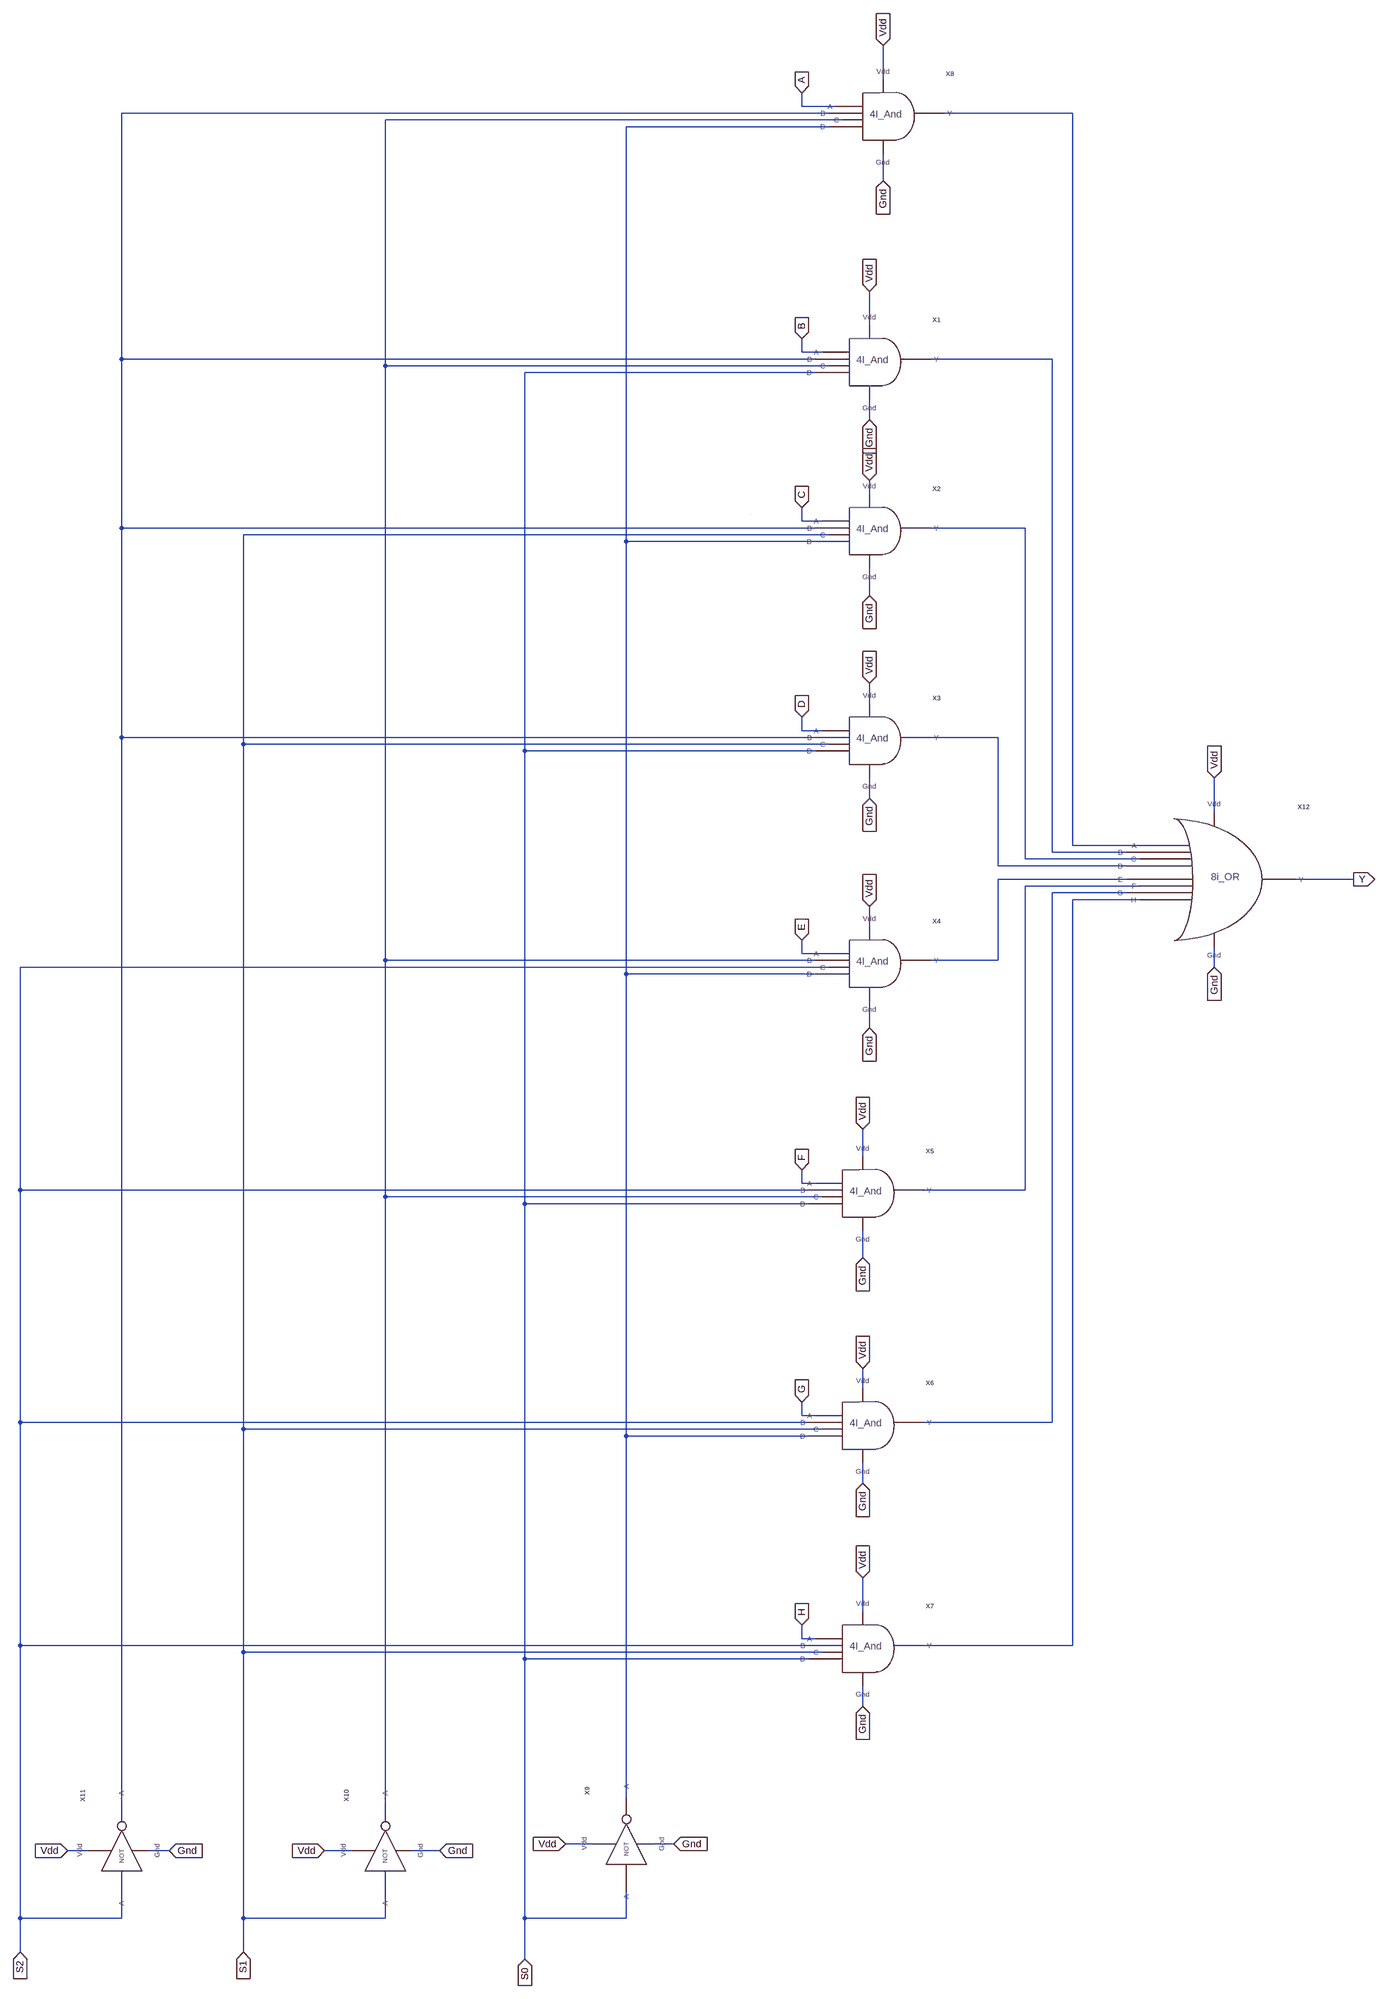
[diagram p0: schematic ALU_MUX.asc]
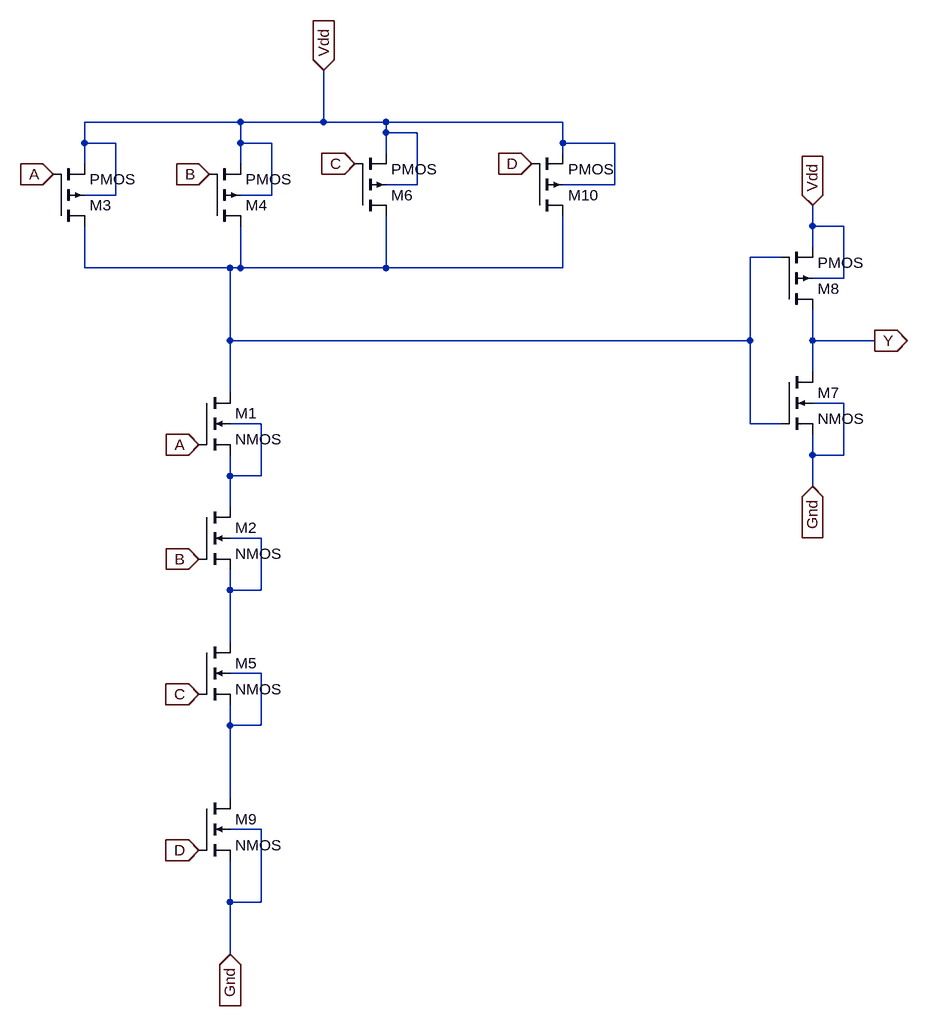
[diagram p1: sub-circuit 4iand.asc]
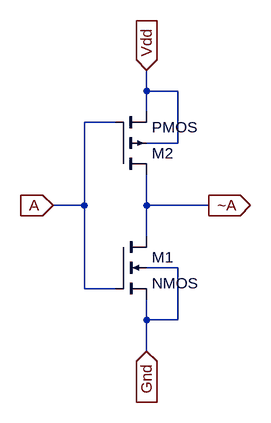
[diagram p2: sub-circuit not.asc]
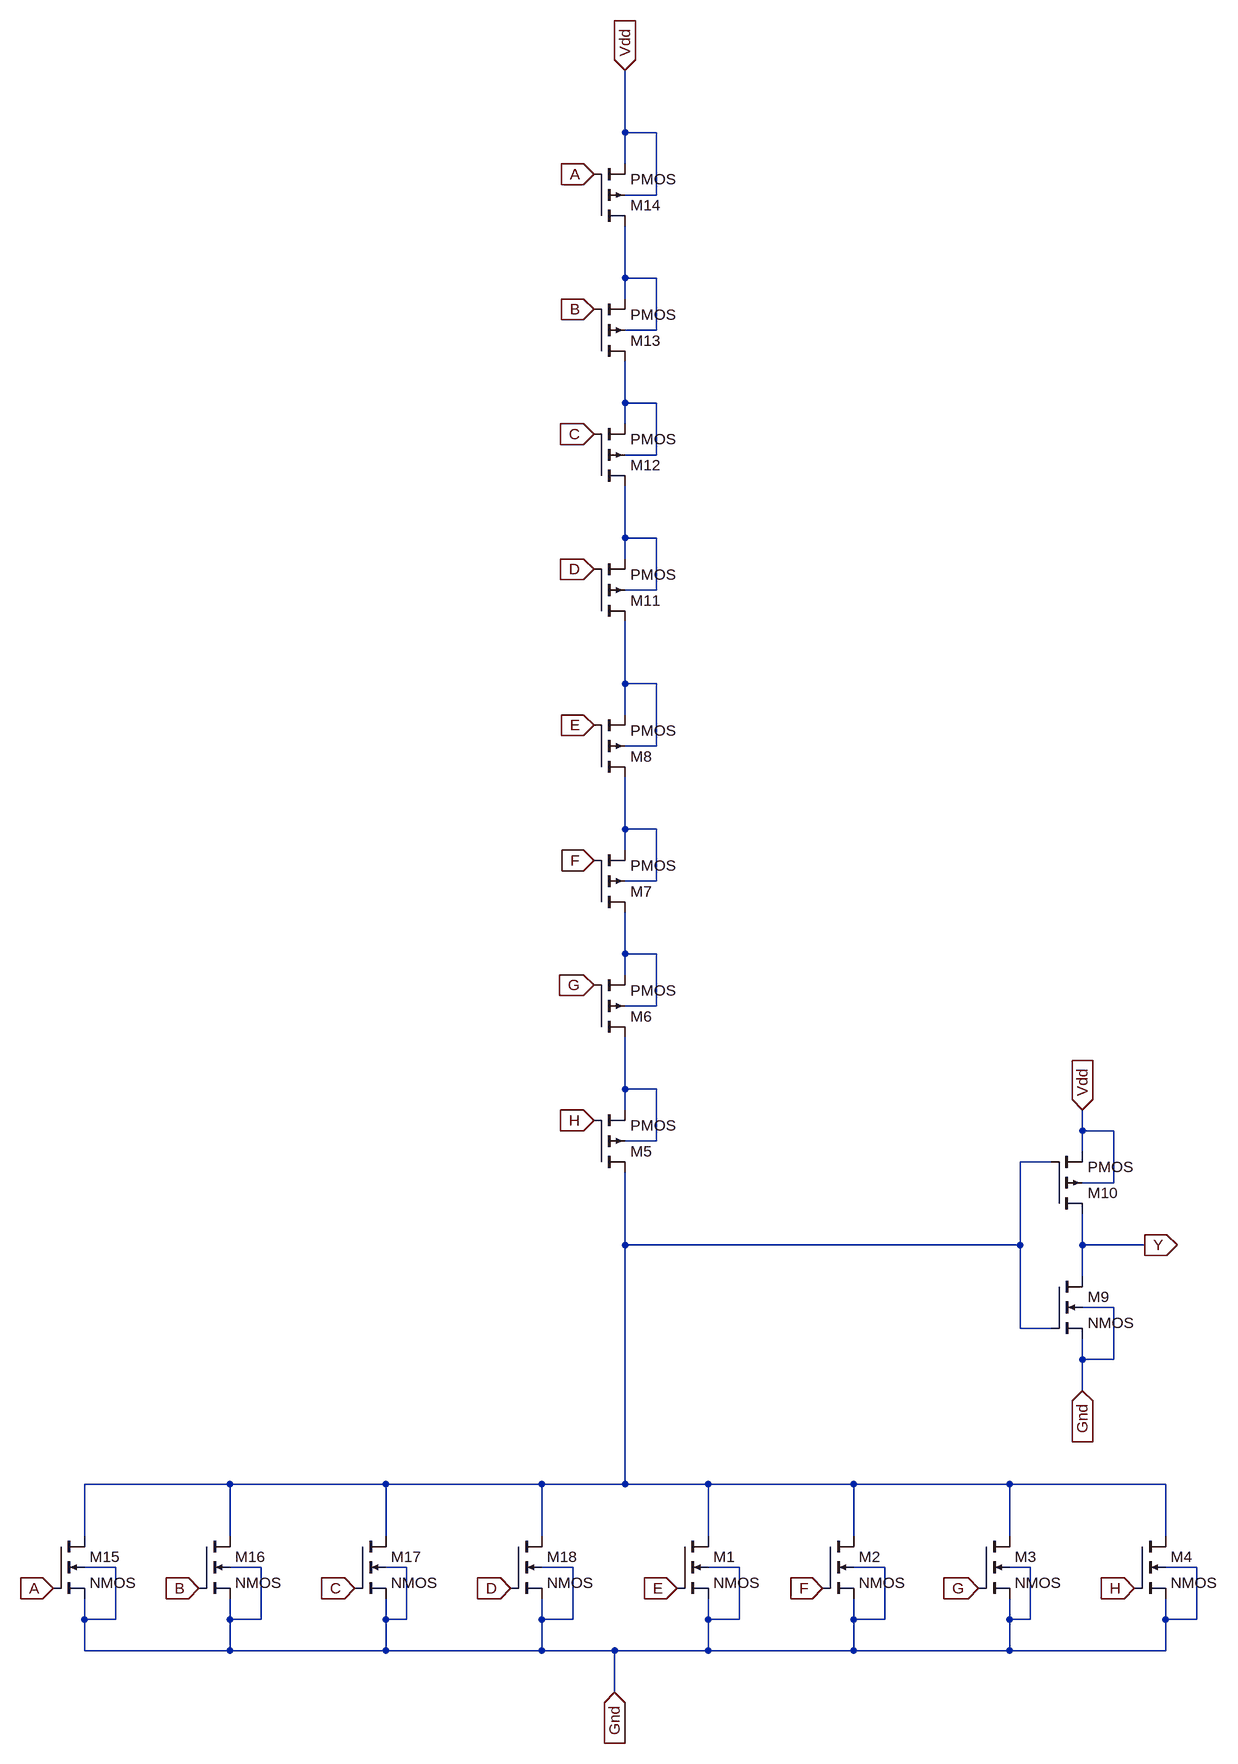
[diagram p3: sub-circuit 8i_or.asc]
ALU_MUX.asc, the LTspice schematic file:
Version 4
SHEET 1 3116 3720
WIRE 656 -1040 656 -1120
WIRE 464 -976 464 -1008
WIRE 544 -976 464 -976
WIRE 528 -960 -1696 -960
WIRE 1776 -960 800 -960
WIRE 560 -944 -1072 -944
WIRE 528 -928 -480 -928
WIRE 656 -800 656 -864
WIRE 624 -448 624 -528
WIRE 464 -384 464 -416
WIRE 512 -384 464 -384
WIRE -1696 -368 -1696 -960
WIRE 496 -368 -1696 -368
WIRE 1728 -368 768 -368
WIRE -1072 -352 -1072 -944
WIRE 528 -352 -1072 -352
WIRE 496 -336 -720 -336
WIRE 624 -224 624 -272
WIRE 624 -48 624 -80
WIRE 464 16 464 -16
WIRE 512 16 464 16
WIRE -1696 32 -1696 -368
WIRE 496 32 -1696 32
WIRE 1664 32 768 32
WIRE 528 48 -1408 48
WIRE -480 64 -480 -928
WIRE 496 64 -480 64
WIRE 624 192 624 128
WIRE 624 448 624 400
WIRE 464 512 464 480
WIRE 512 512 464 512
WIRE -1696 528 -1696 32
WIRE 496 528 -1696 528
WIRE 1600 528 768 528
WIRE -1408 544 -1408 48
WIRE 528 544 -1408 544
WIRE -720 560 -720 -336
WIRE 496 560 -720 560
WIRE 624 672 624 624
WIRE 2160 704 2160 624
WIRE 1776 784 1776 -960
WIRE 1984 784 1776 784
WIRE 1728 800 1728 -368
WIRE 1952 800 1728 800
WIRE 1664 816 1664 32
WIRE 1984 816 1664 816
WIRE 1600 832 1600 528
WIRE 1952 832 1600 832
WIRE 1952 864 1600 864
WIRE 2496 864 2352 864
WIRE 1984 880 1664 880
WIRE 1952 896 1728 896
WIRE 1984 912 1776 912
WIRE 624 976 624 928
WIRE 464 1040 464 1008
WIRE 512 1040 464 1040
WIRE -1072 1056 -1072 -352
WIRE 496 1056 -1072 1056
WIRE 1600 1056 1600 864
WIRE 1600 1056 768 1056
WIRE 528 1072 -1936 1072
WIRE 2160 1072 2160 1024
WIRE -480 1088 -480 64
WIRE 496 1088 -480 1088
WIRE 624 1216 624 1152
WIRE 608 1520 608 1456
WIRE 464 1584 464 1552
WIRE 496 1584 464 1584
WIRE -1936 1600 -1936 1072
WIRE 480 1600 -1936 1600
WIRE 1664 1600 1664 880
WIRE 1664 1600 752 1600
WIRE -1072 1616 -1072 1056
WIRE 512 1616 -1072 1616
WIRE -720 1632 -720 560
WIRE 480 1632 -720 1632
WIRE 608 1760 608 1696
WIRE 608 2080 608 2032
WIRE 464 2144 464 2112
WIRE 496 2144 464 2144
WIRE -1936 2160 -1936 1600
WIRE 480 2160 -1936 2160
WIRE 1728 2160 1728 896
WIRE 1728 2160 752 2160
WIRE -1408 2176 -1408 544
WIRE 512 2176 -1408 2176
WIRE -480 2192 -480 1088
WIRE 480 2192 -480 2192
WIRE 608 2304 608 2256
WIRE 608 2608 608 2528
WIRE 464 2672 464 2640
WIRE 496 2672 464 2672
WIRE -1936 2688 -1936 2160
WIRE 480 2688 -1936 2688
WIRE 1776 2688 1776 912
WIRE 1776 2688 752 2688
WIRE -1408 2704 -1408 2176
WIRE 512 2704 -1408 2704
WIRE -720 2720 -720 1632
WIRE 480 2720 -720 2720
WIRE 608 2832 608 2784
WIRE -480 3248 -480 2192
WIRE -1696 3264 -1696 528
WIRE -1072 3264 -1072 1616
WIRE -560 3360 -624 3360
WIRE -368 3360 -416 3360
WIRE -1776 3376 -1824 3376
WIRE -1584 3376 -1632 3376
WIRE -1152 3376 -1216 3376
WIRE -944 3376 -1008 3376
WIRE -1936 3536 -1936 2688
WIRE -1696 3536 -1696 3488
WIRE -1696 3536 -1936 3536
WIRE -1408 3536 -1408 2704
WIRE -1072 3536 -1072 3488
WIRE -1072 3536 -1408 3536
WIRE -720 3536 -720 2720
WIRE -480 3536 -480 3472
WIRE -480 3536 -720 3536
WIRE -1936 3616 -1936 3536
WIRE -1408 3616 -1408 3536
WIRE -720 3632 -720 3536
WIRE 0 0 0 0
FLAG 464 2640 H
IOPIN 464 2640 In
FLAG 464 2112 G
IOPIN 464 2112 In
FLAG 464 1552 F
IOPIN 464 1552 In
FLAG 464 1008 E
IOPIN 464 1008 In
FLAG 464 480 D
IOPIN 464 480 In
FLAG 464 -16 C
IOPIN 464 -16 In
FLAG 464 -416 B
IOPIN 464 -416 In
FLAG 464 -1008 A
IOPIN 464 -1008 In
FLAG -720 3632 S0
IOPIN -720 3632 In
FLAG -1408 3616 S1
IOPIN -1408 3616 In
FLAG -1936 3616 S2
IOPIN -1936 3616 In
FLAG 656 -1120 Vdd
IOPIN 656 -1120 In
FLAG 656 -800 Gnd
IOPIN 656 -800 In
FLAG 624 -528 Vdd
IOPIN 624 -528 In
FLAG 624 -224 Gnd
IOPIN 624 -224 In
FLAG 624 -80 Vdd
IOPIN 624 -80 In
FLAG 624 192 Gnd
IOPIN 624 192 In
FLAG 624 672 Gnd
IOPIN 624 672 In
FLAG 624 400 Vdd
IOPIN 624 400 In
FLAG 624 928 Vdd
IOPIN 624 928 In
FLAG 608 1456 Vdd
IOPIN 608 1456 In
FLAG 624 1216 Gnd
IOPIN 624 1216 In
FLAG 608 1760 Gnd
IOPIN 608 1760 In
FLAG 608 2032 Vdd
IOPIN 608 2032 In
FLAG 608 2528 Vdd
IOPIN 608 2528 In
FLAG 608 2304 Gnd
IOPIN 608 2304 In
FLAG 608 2832 Gnd
IOPIN 608 2832 In
FLAG 2496 864 Y
IOPIN 2496 864 Out
FLAG 2160 624 Vdd
IOPIN 2160 624 In
FLAG 2160 1072 Gnd
IOPIN 2160 1072 In
FLAG -944 3376 Gnd
IOPIN -944 3376 In
FLAG -368 3360 Gnd
IOPIN -368 3360 In
FLAG -1584 3376 Gnd
IOPIN -1584 3376 In
FLAG -1824 3376 Vdd
IOPIN -1824 3376 In
FLAG -1216 3376 Vdd
IOPIN -1216 3376 In
FLAG -624 3360 Vdd
IOPIN -624 3360 In
SYMBOL 4iAND 640 -368 R0
SYMATTR InstName X1
SYMBOL 4iAND 640 32 R0
SYMATTR InstName X2
SYMBOL 4iAND 640 528 R0
SYMATTR InstName X3
SYMBOL 4iAND 640 1056 R0
SYMATTR InstName X4
SYMBOL 4iAND 624 1600 R0
SYMATTR InstName X5
SYMBOL 4iAND 624 2160 R0
SYMATTR InstName X6
SYMBOL 4iAND 624 2688 R0
SYMATTR InstName X7
SYMBOL 4iAND 672 -960 R0
SYMATTR InstName X8
SYMBOL NOT -496 3360 R270
SYMATTR InstName X9
SYMBOL NOT -1088 3376 R270
SYMATTR InstName X10
SYMBOL NOT -1712 3376 R270
SYMATTR InstName X11
SYMBOL 8i_OR 2208 832 R0
SYMATTR InstName X12

4iand.asc, the sub-circuit schematic file:
Version 4
SHEET 1 1020 1336
WIRE -32 -192 -272 -192
WIRE 96 -192 96 -272
WIRE 96 -192 -32 -192
WIRE 192 -192 96 -192
WIRE 464 -192 192 -192
WIRE 192 -176 192 -192
WIRE 240 -176 192 -176
WIRE -272 -160 -272 -192
WIRE -224 -160 -272 -160
WIRE -32 -160 -32 -192
WIRE 16 -160 -32 -160
WIRE 464 -160 464 -192
WIRE 544 -160 464 -160
WIRE 192 -144 192 -176
WIRE 464 -144 464 -160
WIRE -272 -128 -272 -160
WIRE -32 -128 -32 -160
WIRE 240 -96 240 -176
WIRE 240 -96 192 -96
WIRE 544 -96 544 -160
WIRE 544 -96 464 -96
WIRE -224 -80 -224 -160
WIRE -224 -80 -272 -80
WIRE 16 -80 16 -160
WIRE 16 -80 -32 -80
WIRE 848 -32 848 -64
WIRE 896 -32 848 -32
WIRE 848 0 848 -32
WIRE 800 16 752 16
WIRE -272 32 -272 -32
WIRE -48 32 -272 32
WIRE -32 32 -32 -32
WIRE -32 32 -48 32
WIRE 192 32 192 -48
WIRE 192 32 -32 32
WIRE 464 32 464 -48
WIRE 464 32 192 32
WIRE 896 48 896 -32
WIRE 896 48 848 48
WIRE -48 144 -48 32
WIRE 752 144 752 16
WIRE 752 144 -48 144
WIRE 848 144 848 96
WIRE 944 144 848 144
WIRE 848 192 848 144
WIRE -48 224 -48 144
WIRE 896 240 848 240
WIRE 0 272 -48 272
WIRE 752 272 752 144
WIRE 800 272 752 272
WIRE 848 320 848 288
WIRE 896 320 896 240
WIRE 896 320 848 320
WIRE -48 352 -48 320
WIRE 0 352 0 272
WIRE 0 352 -48 352
WIRE 848 368 848 320
WIRE -48 400 -48 352
WIRE 0 448 -48 448
WIRE -48 528 -48 496
WIRE 0 528 0 448
WIRE 0 528 -48 528
WIRE -48 608 -48 528
WIRE 0 656 -48 656
WIRE -48 736 -48 704
WIRE 0 736 0 656
WIRE 0 736 -48 736
WIRE -48 848 -48 736
WIRE 0 896 -48 896
WIRE -48 1008 -48 944
WIRE 0 1008 0 896
WIRE 0 1008 -48 1008
WIRE -48 1088 -48 1008
FLAG -96 480 B
IOPIN -96 480 In
FLAG -96 304 A
IOPIN -96 304 In
FLAG -320 -112 A
IOPIN -320 -112 In
FLAG -80 -112 B
IOPIN -80 -112 In
FLAG -96 688 C
IOPIN -96 688 In
FLAG 144 -128 C
IOPIN 144 -128 In
FLAG -48 1088 Gnd
IOPIN -48 1088 In
FLAG 848 -64 Vdd
IOPIN 848 -64 In
FLAG 848 368 Gnd
IOPIN 848 368 In
FLAG 944 144 Y
IOPIN 944 144 Out
FLAG -96 928 D
IOPIN -96 928 In
FLAG 416 -128 D
IOPIN 416 -128 In
FLAG 96 -272 Vdd
IOPIN 96 -272 In
SYMBOL nmos4 -96 224 R0
SYMATTR InstName M1
SYMBOL nmos4 -96 400 R0
SYMATTR InstName M2
SYMBOL pmos4 -320 -32 M180
SYMATTR InstName M3
SYMBOL pmos4 -80 -32 M180
SYMATTR InstName M4
SYMBOL nmos4 -96 608 R0
SYMATTR InstName M5
SYMBOL pmos4 144 -48 M180
SYMATTR InstName M6
SYMBOL nmos4 800 192 R0
SYMATTR InstName M7
SYMBOL pmos4 800 96 M180
SYMATTR InstName M8
SYMBOL nmos4 -96 848 R0
SYMATTR InstName M9
SYMBOL pmos4 416 -48 M180
SYMATTR InstName M10

not.asc, the sub-circuit schematic file:
Version 4
SHEET 1 880 680
WIRE 304 -112 304 -144
WIRE 352 -112 304 -112
WIRE 304 -80 304 -112
WIRE 256 -64 208 -64
WIRE 352 -32 352 -112
WIRE 352 -32 304 -32
WIRE 208 64 208 -64
WIRE 208 64 160 64
WIRE 304 64 304 16
WIRE 400 64 304 64
WIRE 304 112 304 64
WIRE 352 160 304 160
WIRE 208 192 208 64
WIRE 256 192 208 192
WIRE 304 240 304 208
WIRE 352 240 352 160
WIRE 352 240 304 240
WIRE 304 288 304 240
FLAG 304 -144 Vdd
IOPIN 304 -144 In
FLAG 160 64 A
IOPIN 160 64 In
FLAG 400 64 ~A
IOPIN 400 64 Out
FLAG 304 288 Gnd
IOPIN 304 288 In
SYMBOL nmos4 256 112 R0
SYMATTR InstName M1
SYMBOL pmos4 256 16 M180
SYMATTR InstName M2

8i_or.asc, the sub-circuit schematic file:
Version 4
SHEET 1 1092 1256
WIRE 176 -1248 176 -1344
WIRE 224 -1248 176 -1248
WIRE 176 -1200 176 -1248
WIRE 224 -1152 224 -1248
WIRE 224 -1152 176 -1152
WIRE 176 -1024 176 -1104
WIRE 224 -1024 176 -1024
WIRE 176 -992 176 -1024
WIRE 224 -944 224 -1024
WIRE 224 -944 176 -944
WIRE 176 -832 176 -896
WIRE 224 -832 176 -832
WIRE 176 -800 176 -832
WIRE 224 -752 224 -832
WIRE 224 -752 176 -752
WIRE 176 -624 176 -704
WIRE 224 -624 176 -624
WIRE 176 -592 176 -624
WIRE 224 -544 224 -624
WIRE 224 -544 176 -544
WIRE 176 -400 176 -496
WIRE 224 -400 176 -400
WIRE 176 -352 176 -400
WIRE 224 -304 224 -400
WIRE 224 -304 176 -304
WIRE 176 -176 176 -256
WIRE 224 -176 176 -176
WIRE 176 -144 176 -176
WIRE 224 -96 224 -176
WIRE 224 -96 176 -96
WIRE 176 16 176 -48
WIRE 224 16 176 16
WIRE 176 48 176 16
WIRE 224 96 224 16
WIRE 224 96 176 96
WIRE 176 224 176 144
WIRE 224 224 176 224
WIRE 176 256 176 224
WIRE 880 288 880 256
WIRE 928 288 880 288
WIRE 224 304 224 224
WIRE 224 304 176 304
WIRE 880 320 880 288
WIRE 832 336 784 336
WIRE 928 368 928 288
WIRE 928 368 880 368
WIRE 176 464 176 352
WIRE 784 464 784 336
WIRE 784 464 176 464
WIRE 880 464 880 416
WIRE 976 464 880 464
WIRE 880 512 880 464
WIRE 928 560 880 560
WIRE 784 592 784 464
WIRE 832 592 784 592
WIRE 880 640 880 608
WIRE 928 640 928 560
WIRE 928 640 880 640
WIRE 880 688 880 640
WIRE -432 832 -656 832
WIRE -192 832 -432 832
WIRE 48 832 -192 832
WIRE 176 832 176 464
WIRE 176 832 48 832
WIRE 304 832 176 832
WIRE 528 832 304 832
WIRE 768 832 528 832
WIRE 1008 832 768 832
WIRE -656 912 -656 832
WIRE -432 912 -432 832
WIRE -192 912 -192 832
WIRE 48 912 48 832
WIRE 304 912 304 832
WIRE 528 912 528 832
WIRE 768 912 768 832
WIRE 1008 912 1008 832
WIRE -608 960 -656 960
WIRE -384 960 -432 960
WIRE -160 960 -192 960
WIRE 96 960 48 960
WIRE 352 960 304 960
WIRE 576 960 528 960
WIRE 800 960 768 960
WIRE 1056 960 1008 960
WIRE -656 1040 -656 1008
WIRE -608 1040 -608 960
WIRE -608 1040 -656 1040
WIRE -432 1040 -432 1008
WIRE -384 1040 -384 960
WIRE -384 1040 -432 1040
WIRE -192 1040 -192 1008
WIRE -160 1040 -160 960
WIRE -160 1040 -192 1040
WIRE 48 1040 48 1008
WIRE 96 1040 96 960
WIRE 96 1040 48 1040
WIRE 304 1040 304 1008
WIRE 352 1040 352 960
WIRE 352 1040 304 1040
WIRE 528 1040 528 1008
WIRE 576 1040 576 960
WIRE 576 1040 528 1040
WIRE 768 1040 768 1008
WIRE 800 1040 800 960
WIRE 800 1040 768 1040
WIRE 1008 1040 1008 1008
WIRE 1056 1040 1056 960
WIRE 1056 1040 1008 1040
WIRE -656 1088 -656 1040
WIRE -432 1088 -432 1040
WIRE -432 1088 -656 1088
WIRE -192 1088 -192 1040
WIRE -192 1088 -432 1088
WIRE 48 1088 48 1040
WIRE 48 1088 -192 1088
WIRE 160 1088 48 1088
WIRE 304 1088 304 1040
WIRE 304 1088 160 1088
WIRE 528 1088 528 1040
WIRE 528 1088 304 1088
WIRE 768 1088 768 1040
WIRE 768 1088 528 1088
WIRE 1008 1088 1008 1040
WIRE 1008 1088 768 1088
WIRE 160 1152 160 1088
FLAG 128 -336 E
IOPIN 128 -336 In
FLAG 128 -128 F
IOPIN 128 -128 In
FLAG 128 64 G
IOPIN 128 64 In
FLAG 128 272 H
IOPIN 128 272 In
FLAG 256 992 E
IOPIN 256 992 In
FLAG 480 992 F
IOPIN 480 992 In
FLAG 720 992 G
IOPIN 720 992 In
FLAG 960 992 H
IOPIN 960 992 In
FLAG 160 1152 Gnd
IOPIN 160 1152 In
FLAG 880 256 Vdd
IOPIN 880 256 In
FLAG 880 688 Gnd
IOPIN 880 688 In
FLAG 976 464 Y
IOPIN 976 464 Out
FLAG 128 -1184 A
IOPIN 128 -1184 In
FLAG 128 -976 B
IOPIN 128 -976 In
FLAG 128 -784 C
IOPIN 128 -784 In
FLAG 128 -576 D
IOPIN 128 -576 In
FLAG 176 -1344 Vdd
IOPIN 176 -1344 In
FLAG -704 992 A
IOPIN -704 992 In
FLAG -480 992 B
IOPIN -480 992 In
FLAG -240 992 C
IOPIN -240 992 In
FLAG 0 992 D
IOPIN 0 992 In
SYMBOL nmos4 256 912 R0
SYMATTR InstName M1
SYMBOL nmos4 480 912 R0
SYMATTR InstName M2
SYMBOL nmos4 720 912 R0
SYMATTR InstName M3
SYMBOL nmos4 960 912 R0
SYMATTR InstName M4
SYMBOL pmos4 128 352 M180
SYMATTR InstName M5
SYMBOL pmos4 128 144 M180
SYMATTR InstName M6
SYMBOL pmos4 128 -48 M180
SYMATTR InstName M7
SYMBOL pmos4 128 -256 M180
SYMATTR InstName M8
SYMBOL nmos4 832 512 R0
SYMATTR InstName M9
SYMBOL pmos4 832 416 M180
SYMATTR InstName M10
SYMBOL pmos4 128 -496 M180
SYMATTR InstName M11
SYMBOL pmos4 128 -704 M180
SYMATTR InstName M12
SYMBOL pmos4 128 -896 M180
SYMATTR InstName M13
SYMBOL pmos4 128 -1104 M180
SYMATTR InstName M14
SYMBOL nmos4 -704 912 R0
SYMATTR InstName M15
SYMBOL nmos4 -480 912 R0
SYMATTR InstName M16
SYMBOL nmos4 -240 912 R0
SYMATTR InstName M17
SYMBOL nmos4 0 912 R0
SYMATTR InstName M18

The netlist it stands for:
* ALU_MUX.asc
XX1 B N001 N003 S0 Vdd Gnd N005 4iand
XX2 C N001 S1 N004 Vdd Gnd N006 4iand
XX3 D N001 S1 S0 Vdd Gnd N007 4iand
XX4 E N003 S2 N004 Vdd Gnd N008 4iand
XX5 F S2 N003 S0 Vdd Gnd N009 4iand
XX6 G S2 S1 N004 Vdd Gnd N010 4iand
XX7 H S2 S1 S0 Vdd Gnd N011 4iand
XX8 A N001 N003 N004 Vdd Gnd N002 4iand
XX9 S0 N004 Vdd Gnd not
XX10 S1 N003 Vdd Gnd not
XX11 S2 N001 Vdd Gnd not
XX12 N002 N005 N006 N007 N008 N009 N010 N011 Vdd Gnd Y 8i_or

* block symbol definitions
.subckt 4iand A B C D Vdd Gnd Y
M1 N001 A N002 N002 NMOS
M2 N002 B N003 N003 NMOS
M3 N001 A Vdd Vdd PMOS
M4 N001 B Vdd Vdd PMOS
M5 N003 C N004 N004 NMOS
M6 N001 C Vdd Vdd PMOS
M7 Y N001 Gnd Gnd NMOS
M8 Y N001 Vdd Vdd PMOS
M9 N004 D Gnd Gnd NMOS
M10 N001 D Vdd Vdd PMOS
.ends 4iand

.subckt not A ~A Vdd Gnd
M1 ~A A Gnd Gnd NMOS
M2 ~A A Vdd Vdd PMOS
.ends not

.subckt 8i_or A B C D E F G H Vdd Gnd Y
M1 N008 E Gnd Gnd NMOS
M2 N008 F Gnd Gnd NMOS
M3 N008 G Gnd Gnd NMOS
M4 N008 H Gnd Gnd NMOS
M5 N008 H N007 N007 PMOS
M6 N007 G N006 N006 PMOS
M7 N006 F N005 N005 PMOS
M8 N005 E N004 N004 PMOS
M9 Y N008 Gnd Gnd NMOS
M10 Y N008 Vdd Vdd PMOS
M11 N004 D N003 N003 PMOS
M12 N003 C N002 N002 PMOS
M13 N002 B N001 N001 PMOS
M14 N001 A Vdd Vdd PMOS
M15 N008 A Gnd Gnd NMOS
M16 N008 B Gnd Gnd NMOS
M17 N008 C Gnd Gnd NMOS
M18 N008 D Gnd Gnd NMOS
.ends 8i_or

.model NMOS NMOS
.model PMOS PMOS
.lib standard.mos
.backanno
.end